# EAGLE schematic PCB Telemetria 2020 (EAGLE 9.5.2)

## Sheet 1 of 5: TBEAM
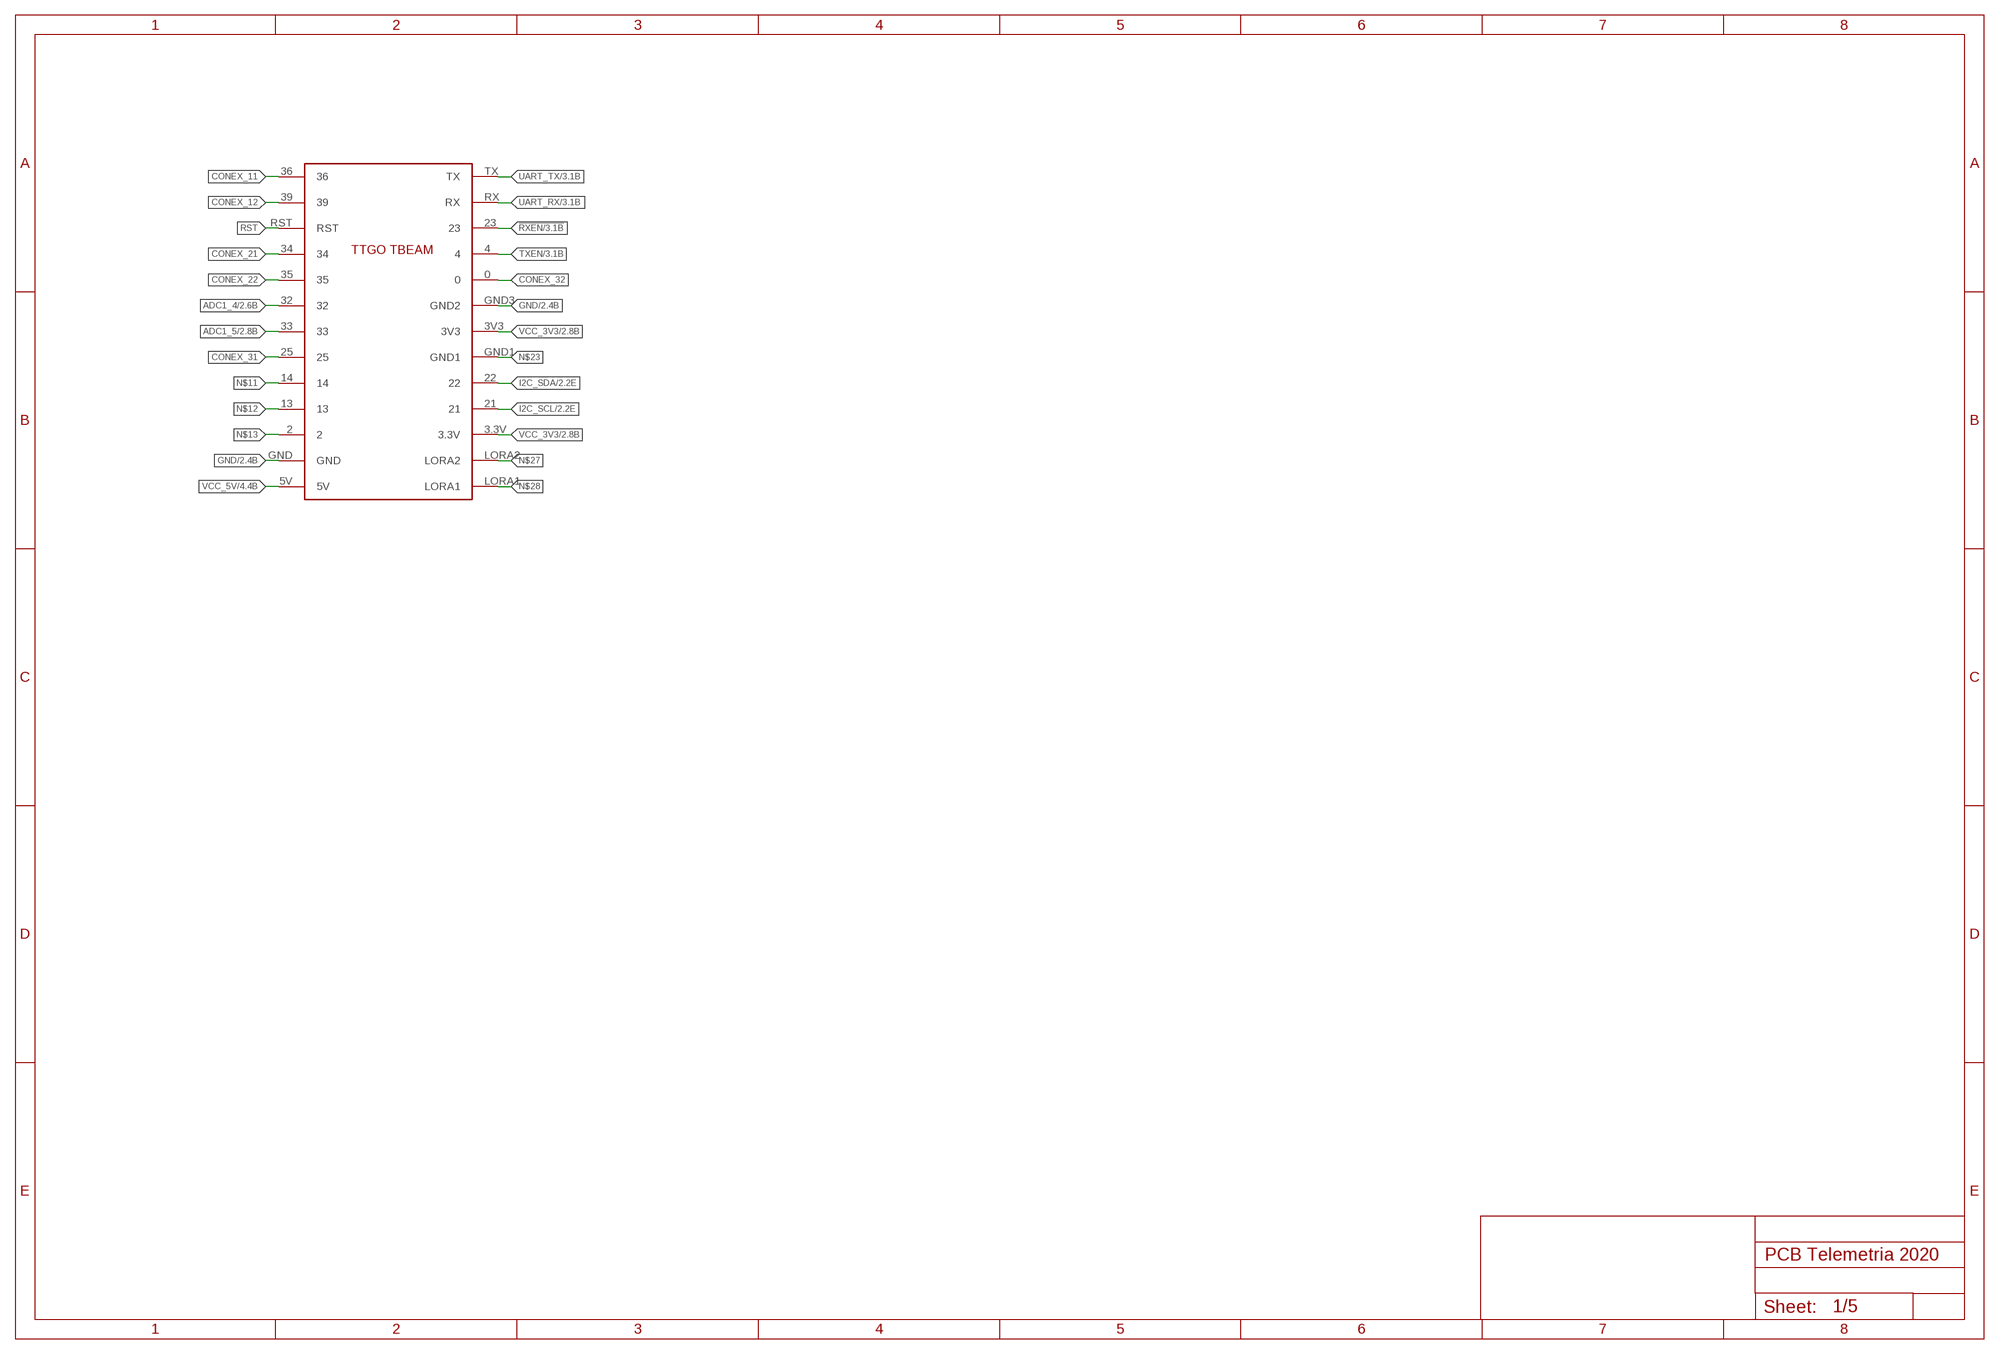
[diagram p0: schematic, sheet 1]

### Parts
U$1  TTGOBEAM  [TTGOBEAM]

### Nets
!RXEN: U$1.23 ; also sheet 3
ADC1_4: U$1.32 ; also sheet 2
ADC1_5: U$1.33 ; also sheet 2
CONEX_11: U$1.36
CONEX_12: U$1.39
CONEX_21: U$1.34
CONEX_22: U$1.35
CONEX_31: U$1.25
CONEX_32: U$1.0
GND: U$1.GND U$1.GND3(GND2) ; also sheet 2,3,4
I2C_SCL: U$1.21 ; also sheet 2
I2C_SDA: U$1.22 ; also sheet 2
N$11: U$1.14
N$12: U$1.13
N$13: U$1.2
N$23: U$1.GND1
N$27: U$1.LORA2
N$28: U$1.LORA1
RST: U$1.RST
TXEN: U$1.4 ; also sheet 3
UART_RX: U$1.RX ; also sheet 3
UART_TX: U$1.TX ; also sheet 3
VCC_3V3: U$1.3.3V U$1.3V3 ; also sheet 2,3,4
VCC_5V: U$1.5V ; also sheet 4

## Sheet 2 of 5: Analog Circuits
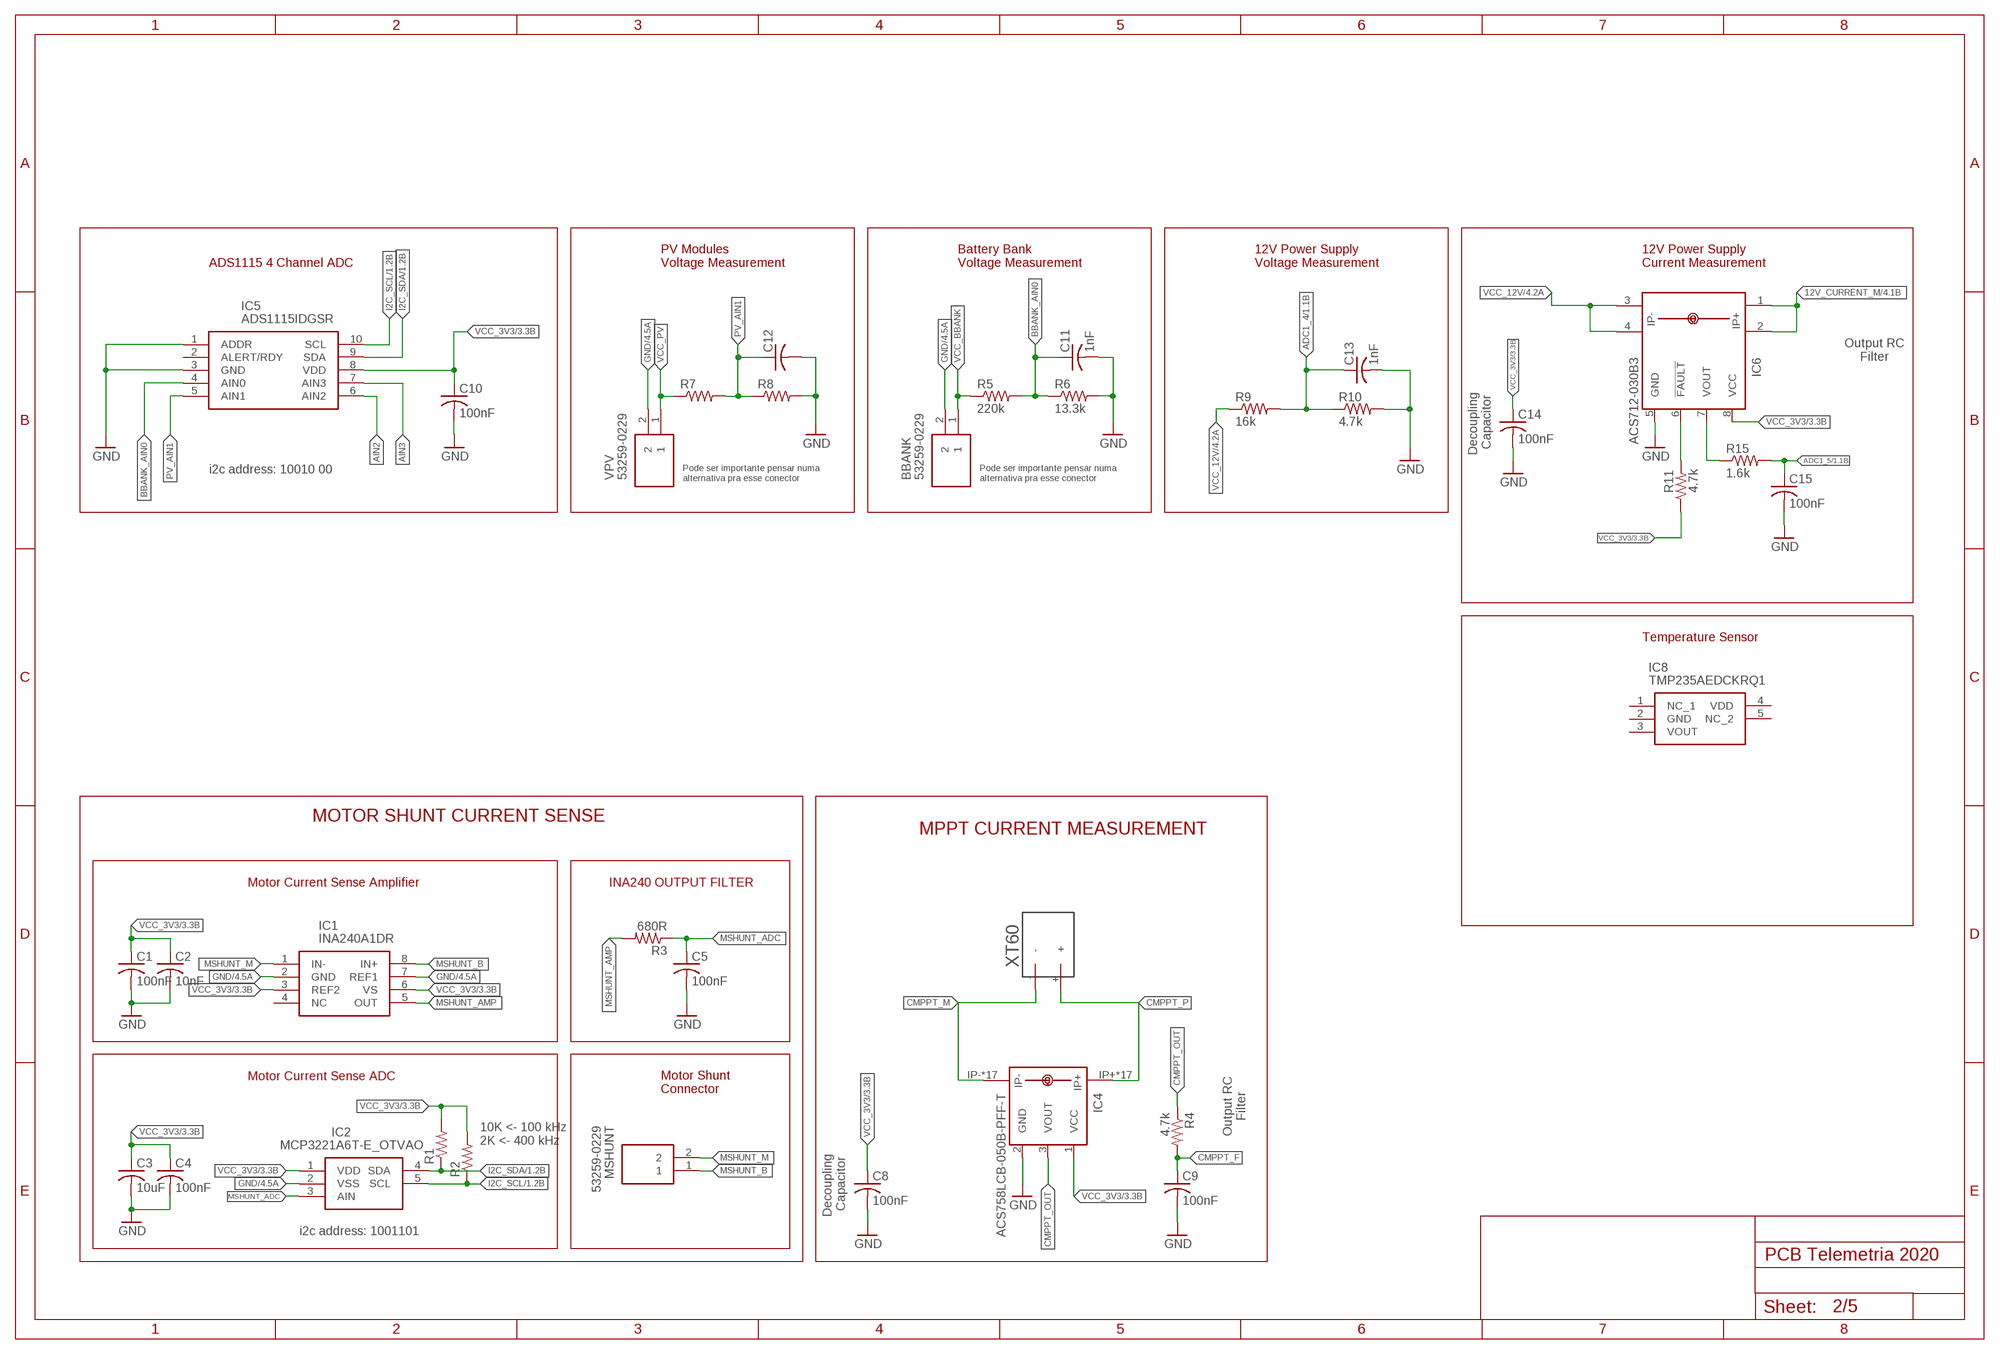
[diagram p1: schematic, sheet 2]

### Parts
BBANK  53259-0229  [0532590229]
C1  100nF  C-USC0805  [C0805]
C2  10nF  C-USC0805  [C0805]
C3  10uF  C-USC0805  [C0805]
C4  100nF  C-USC0805  [C0805]
C5  100nF  C-USC0805  [C0805]
C8  100nF  C-USC0805  [C0805]
C9  100nF  C-USC0805  [C0805]
C10  100nF  C-USC0805  [C0805]
C11  1nF  C-USC0805  [C0805]
C12  C-USC0805  [C0805]
C13  1nF  C-USC0805  [C0805]
C14  100nF  C-USC0805  [C0805]
C15  100nF  C-USC0805  [C0805]
IC1  INA240A1DR  [SOIC127P600X175-8N]
IC2  MCP3221A6T-E_OTVAO  [SOT95P280X145-5N]
IC4  ACS758LCB-050B-PFF-T  [CB-PFF]
IC5  ADS1115IDGSR  [SOP50P490X110-10N]
IC6  ACS712-030B3  ACS712-LC  [SOIC8]
IC8  TMP235AEDCKRQ1  [SOT65P210X110-5N]
MSHUNT  53259-0229  [0532590229]
R1  R-US_R0805  [R0805]
R2  R-US_R0805  [R0805]
R3  680R  R-US_R0805  [R0805]
R4  4.7k  R-US_R0805  [R0805]
R5  220k  R-US_R0805  [R0805]
R6  13.3k  R-US_R0805  [R0805]
R7  R-US_R0805  [R0805]
R8  R-US_R0805  [R0805]
R9  16k  R-US_R0805  [R0805]
R10  4.7k  R-US_R0805  [R0805]
R11  4.7k  R-US_R0805  [R0805]
R15  1.6k  R-US_R0805  [R0805]
U$3  XT60  [XT60]
VPV  53259-0229  [0532590229]

### Nets
12V_CURRENT_M: IC6.1(IP+) IC6.2(IP+1) ; also sheet 4
ADC1_4: C13.1 R9.2 R10.1 ; also sheet 1
ADC1_5: C15.1 R15.2 ; also sheet 1
AIN2: IC5.6(AIN2)
AIN3: IC5.7(AIN3)
BBANK_AIN0: C11.1 IC5.4(AIN0) R5.2 R6.1
CMPPT_F: C9.1 R4.2
CMPPT_M: IC4.IP- IC4.IP-@2(IP-) IC4.IP-@3(IP-) IC4.IP-@4(IP-) IC4.IP-@5(IP-) IC4.IP-@6(IP-) IC4.IP-@7(IP-) IC4.IP-@8(IP-) IC4.IP-@9(IP-) IC4.IP-@10(IP-) IC4.IP-@11(IP-) IC4.IP-@12(IP-) IC4.IP-@13(IP-) IC4.IP-@14(IP-) IC4.IP-@15(IP-) IC4.IP-@16(IP-) IC4.IP-@17(IP-) U$3.-
CMPPT_OUT: IC4.3(VOUT) R4.1
CMPPT_P: IC4.IP+ IC4.IP+@2(IP+) IC4.IP+@3(IP+) IC4.IP+@4(IP+) IC4.IP+@5(IP+) IC4.IP+@6(IP+) IC4.IP+@7(IP+) IC4.IP+@8(IP+) IC4.IP+@9(IP+) IC4.IP+@10(IP+) IC4.IP+@11(IP+) IC4.IP+@12(IP+) IC4.IP+@13(IP+) IC4.IP+@14(IP+) IC4.IP+@15(IP+) IC4.IP+@16(IP+) IC4.IP+@17(IP+) U$3.+
GND: BBANK.2 C1.2 C2.2 C3.2 C4.2 C5.2 C8.2 C9.2 C10.2 C11.2 C12.2 C13.2 C14.2 C15.2 IC1.2(GND) IC1.7(REF1) IC2.2(VSS) IC4.2(GND) IC5.1(ADDR) IC5.3(GND) IC6.5(GND) R6.2 R8.2 R10.2 VPV.2 ; also sheet 1,3,4
I2C_SCL: IC2.5(SCL) IC5.10(SCL) R2.1 ; also sheet 1
I2C_SDA: IC2.4(SDA) IC5.9(SDA) R1.1 ; also sheet 1
MSHUNT_ADC: C5.1 IC2.3(AIN) R3.1
MSHUNT_AMP: IC1.5(OUT) R3.2
MSHUNT_B: IC1.8(IN+) MSHUNT.1
MSHUNT_M: IC1.1(IN-) MSHUNT.2
N$1: IC6.6(!FAULT) R11.2
N$2: IC6.7(VOUT) R15.1
PV_AIN1: C12.1 IC5.5(AIN1) R7.2 R8.1
VCC_3V3: C1.1 C2.1 C3.1 C4.1 C8.1 C10.1 C14.1 IC1.3(REF2) IC1.6(VS) IC2.1(VDD) IC4.1(VCC) IC5.8(VDD) IC6.8(VCC) R1.2 R2.2 R11.1 ; also sheet 1,3,4
VCC_12V: IC6.3(IP-) IC6.4(IP-1) R9.1 ; also sheet 4
VCC_BBANK: BBANK.1 R5.1
VCC_PV: R7.1 VPV.1
Unconnected: IC1.4(NC) IC5.2(ALERT/RDY) IC8.1(NC_1) IC8.2(GND) IC8.3(VOUT) IC8.4(VDD) IC8.5(NC_2)

### Notes on the sheet
- ADS1115 4 Channel ADC
- PV Modules
  Voltage Measurement
- Battery Bank
  Voltage Measurement
- 12V Power Supply
  Voltage Measurement
- 12V Power Supply
  Current Measurement
- Output RC
  Filter
- Decoupling 
  Capacitor
- i2c address: 10010 00
- Pode ser importante pensar numa
  alternativa pra esse conector
- Pode ser importante pensar numa
  alternativa pra esse conector
- Temperature Sensor
- MOTOR SHUNT CURRENT SENSE
- MPPT CURRENT MEASUREMENT
- Motor Current Sense Amplifier | INA240 OUTPUT FILTER
- Motor Current Sense ADC
- Motor Shunt 
  Connector
- Output RC
  Filter
- 10K <- 100 kHz
  2K <- 400 kHz
- Decoupling 
  Capacitor
- i2c address: 1001101

## Sheet 3 of 5: Communication
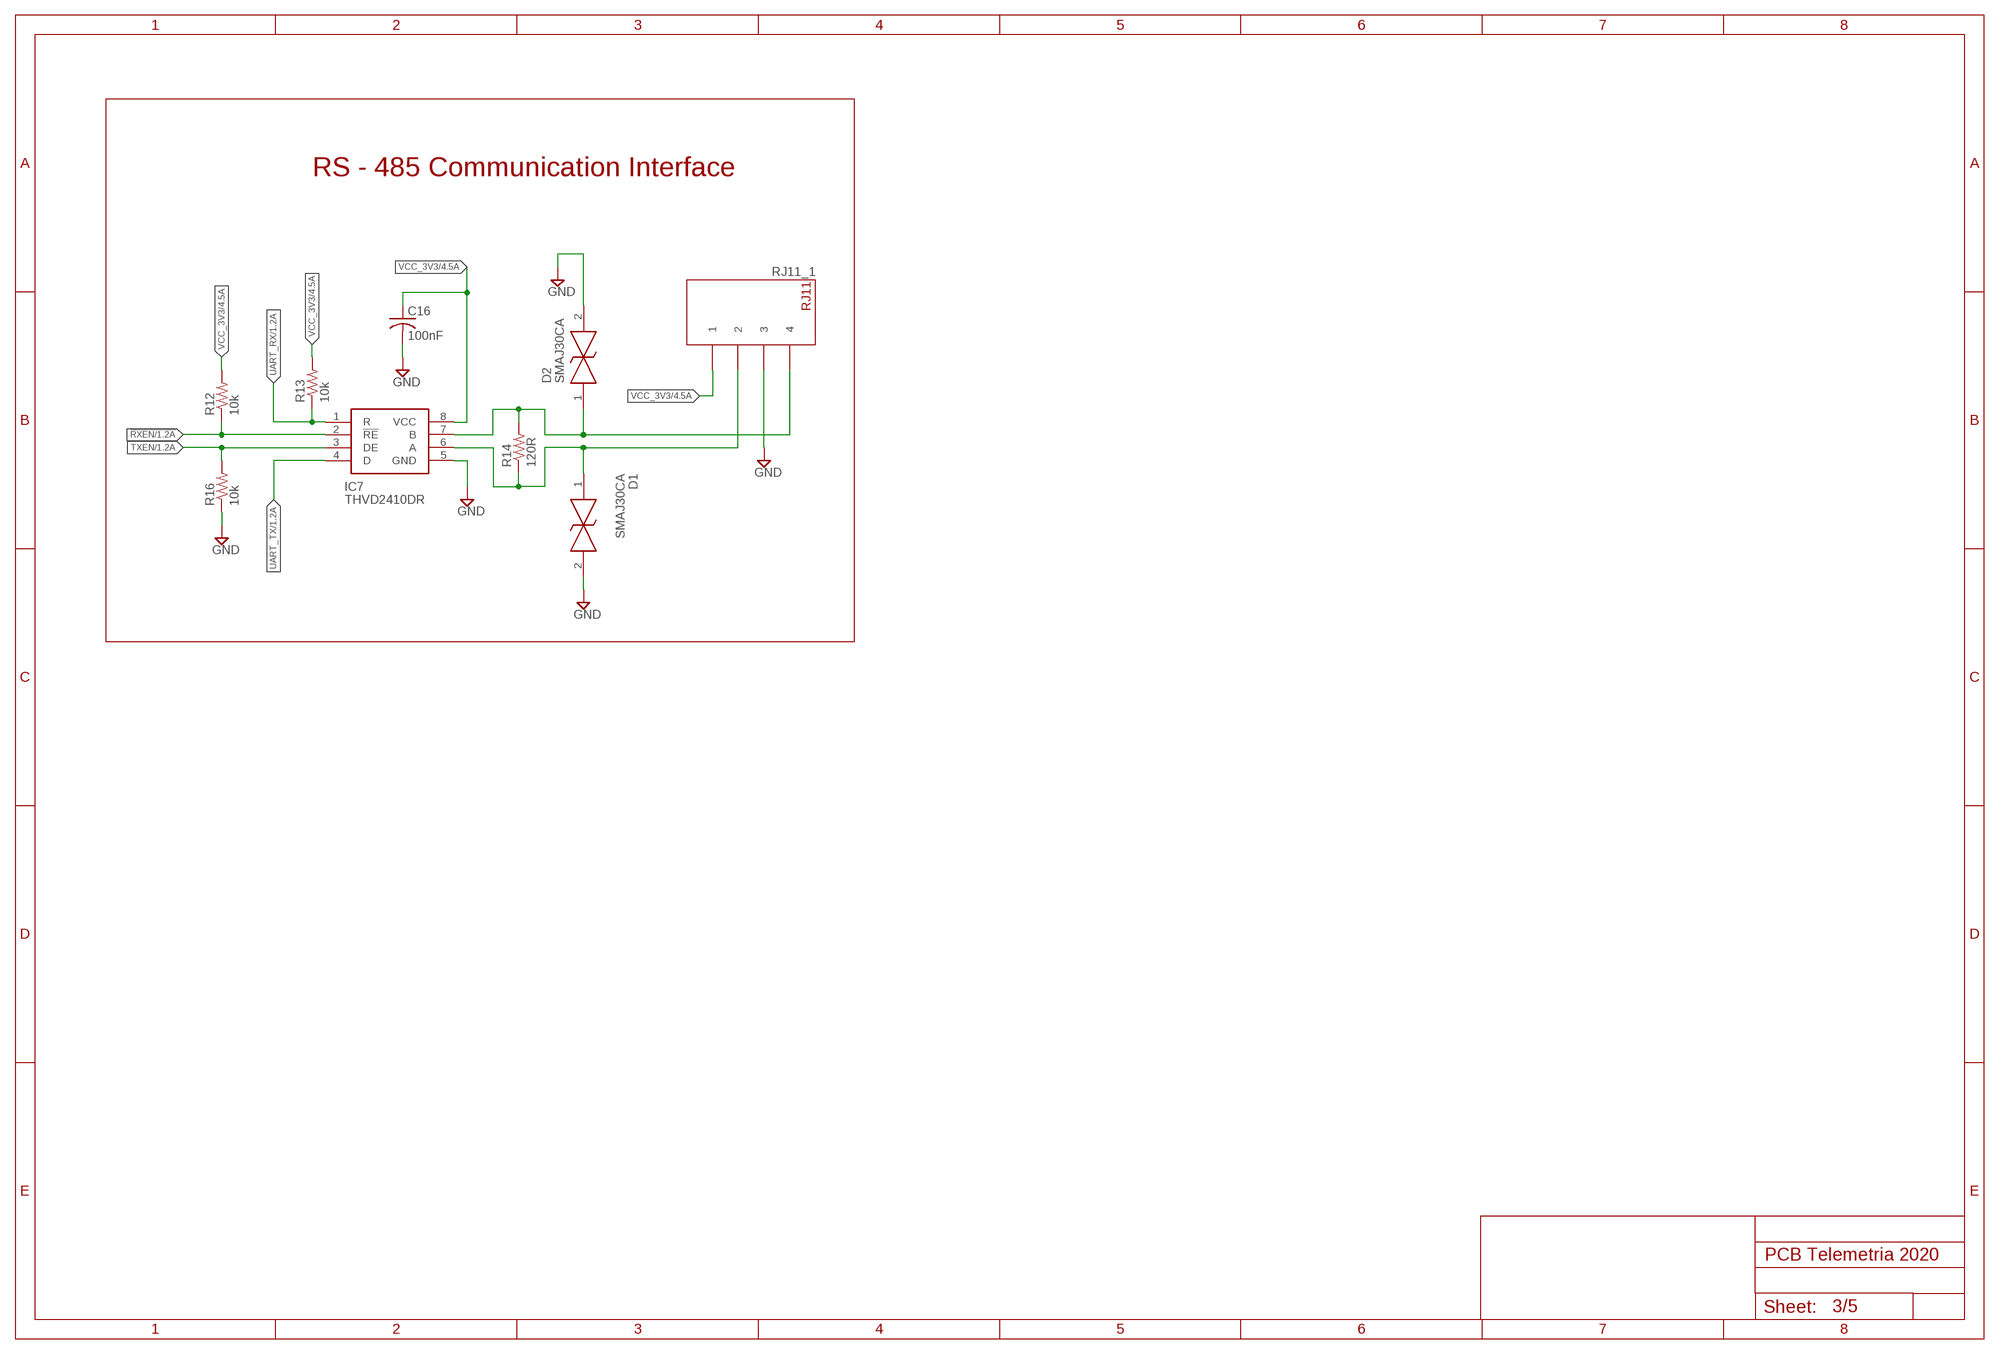
[diagram p2: schematic, sheet 3]

### Parts
C16  100nF  C-USC0805  [C0805]
D1  SMAJ30CA  [DIONM5026X229N]
D2  SMAJ30CA  [DIONM5026X229N]
IC7  THVD2410DR  [SOIC127P600X175-8N]
R12  10k  R-US_M0805  [M0805]
R13  10k  R-US_M0805  [M0805]
R14  120R  R-US_M0805  [M0805]
R16  10k  R-US_M0805  [M0805]
RJ11_1  TFC44  [TFC44]

### Nets
!RXEN: IC7.2(!RE) R12.1 ; also sheet 1
GND: C16.2 D1.2 D2.2 IC7.5(GND) R16.1 RJ11_1.P$3 ; also sheet 1,2,4
N$9: D1.1 IC7.6(A) R14.1 RJ11_1.P$2
N$14: D2.1 IC7.7(B) R14.2 RJ11_1.P$4
TXEN: IC7.3(DE) R16.2 ; also sheet 1
UART_RX: IC7.1(R) R13.1 ; also sheet 1
UART_TX: IC7.4(D) ; also sheet 1
VCC_3V3: C16.1 IC7.8(VCC) R12.2 R13.2 RJ11_1.P$1 ; also sheet 1,2,4

### Notes on the sheet
- RS - 485 Communication Interface

## Sheet 4 of 5: Power
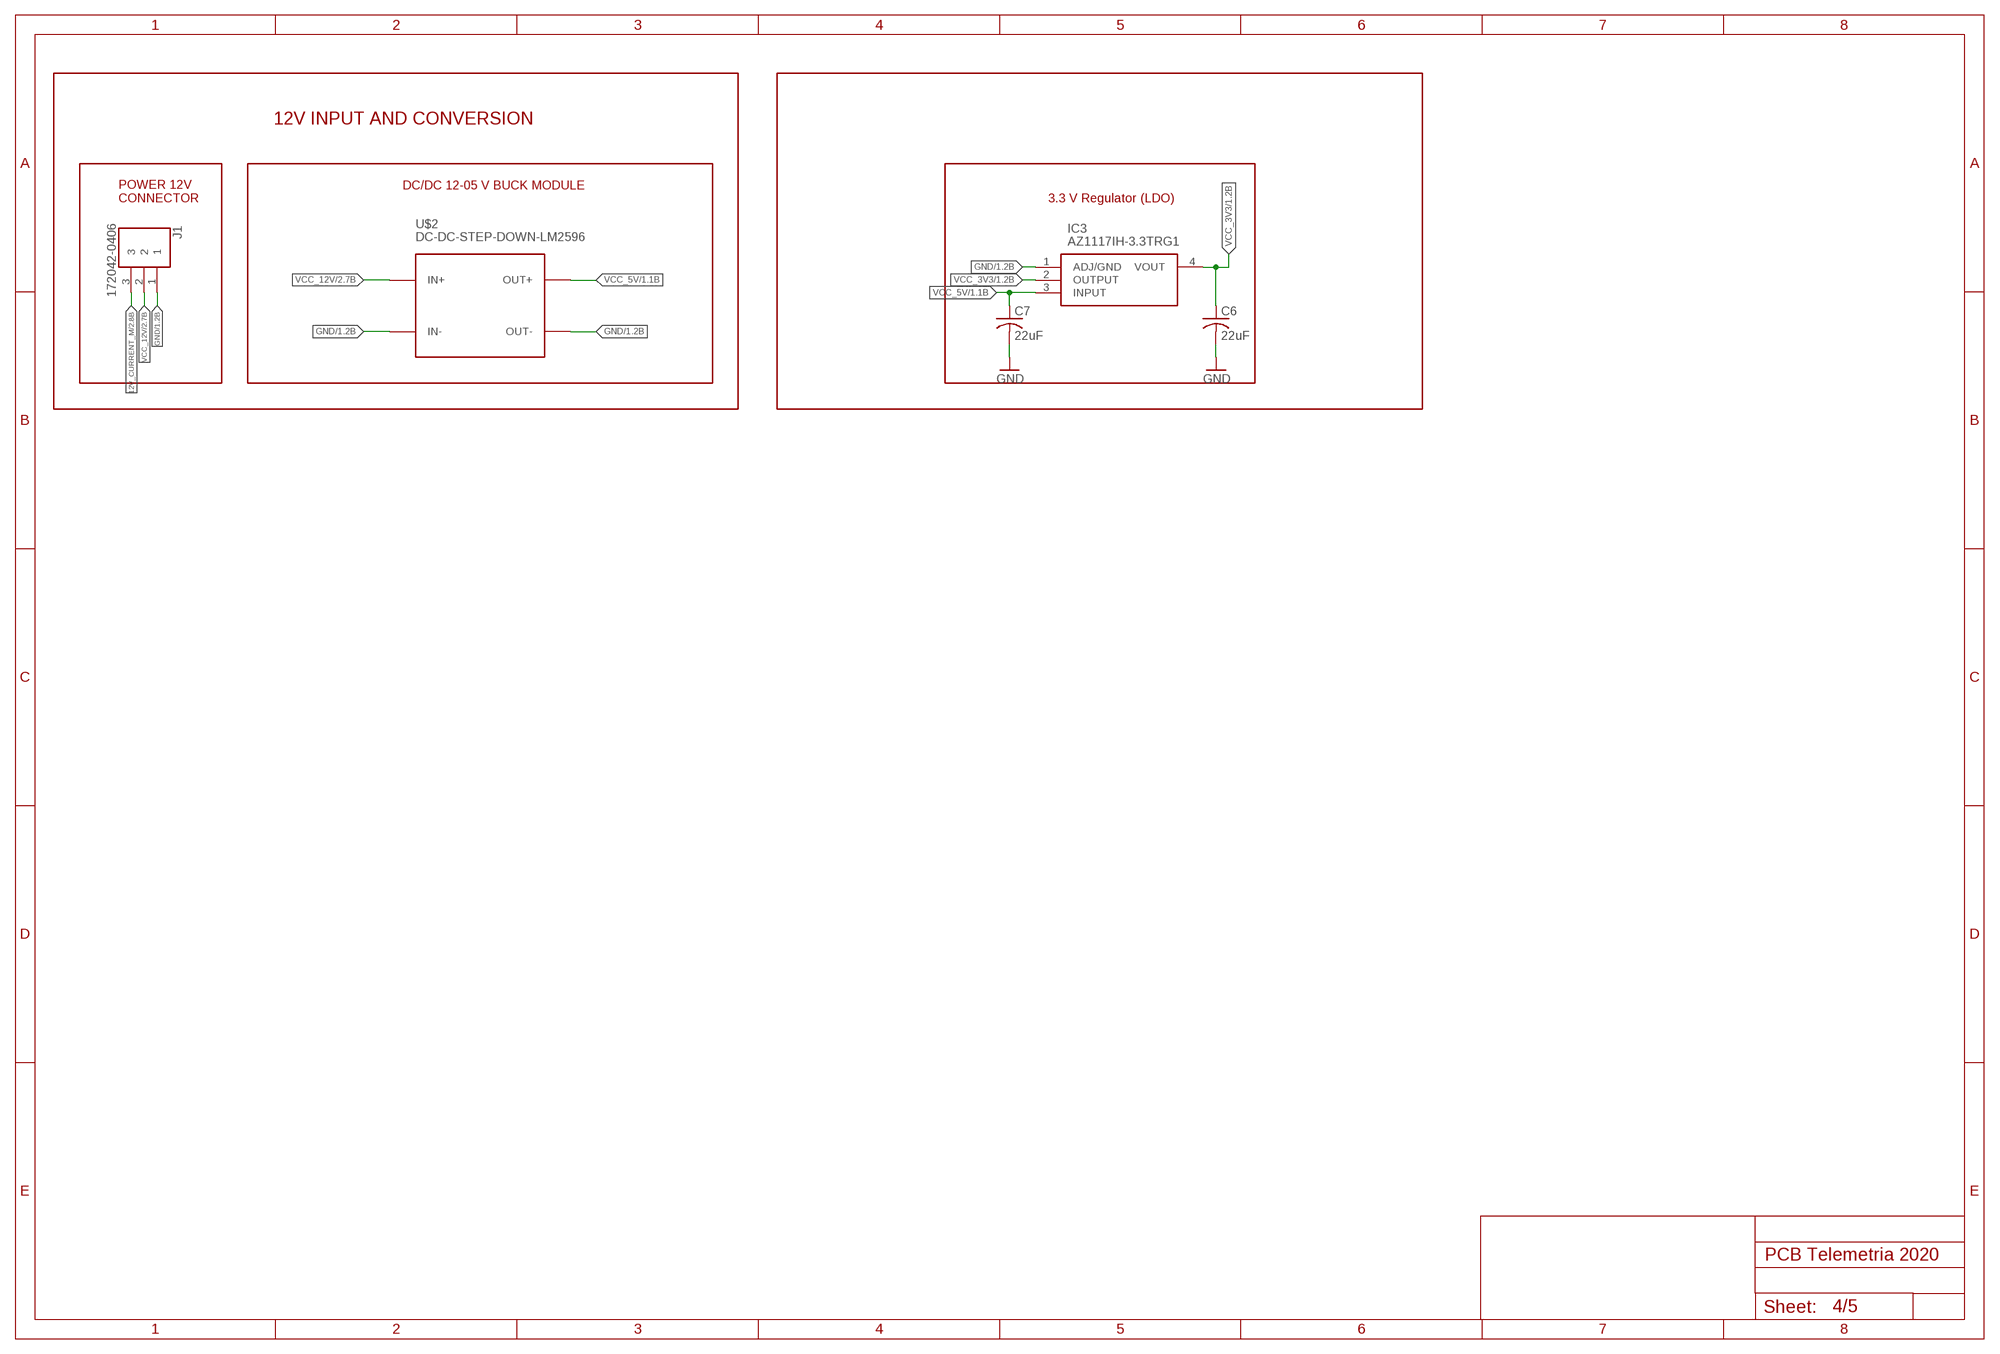
[diagram p3: schematic, sheet 4]

### Parts
C6  22uF  C-USC0805  [C0805]
C7  22uF  C-USC0805  [C0805]
IC3  AZ1117IH-3.3TRG1  [SOT230P700X170-4N]
J1  172042-0406  [MOLEX_172042-0406]
U$2  DC-DC-STEP-DOWN-LM2596  [DC-DC-STEP-DOWN-LM2596]

### Nets
12V_CURRENT_M: J1.3 ; also sheet 2
GND: C6.2 C7.2 IC3.1(ADJ/GND) J1.1 U$2.IN- U$2.OUT- ; also sheet 1,2,3
VCC_3V3: C6.1 IC3.2(OUTPUT) IC3.4(VOUT) ; also sheet 1,2,3
VCC_5V: C7.1 IC3.3(INPUT) U$2.OUT+ ; also sheet 1
VCC_12V: J1.2 U$2.IN+ ; also sheet 2

### Notes on the sheet
- 12V INPUT AND CONVERSION
- DC/DC 12-05 V BUCK MODULE
- POWER 12V
  CONNECTOR
- 3.3 V Regulator (LDO)

## Sheet 5 of 5: Extra Connectors
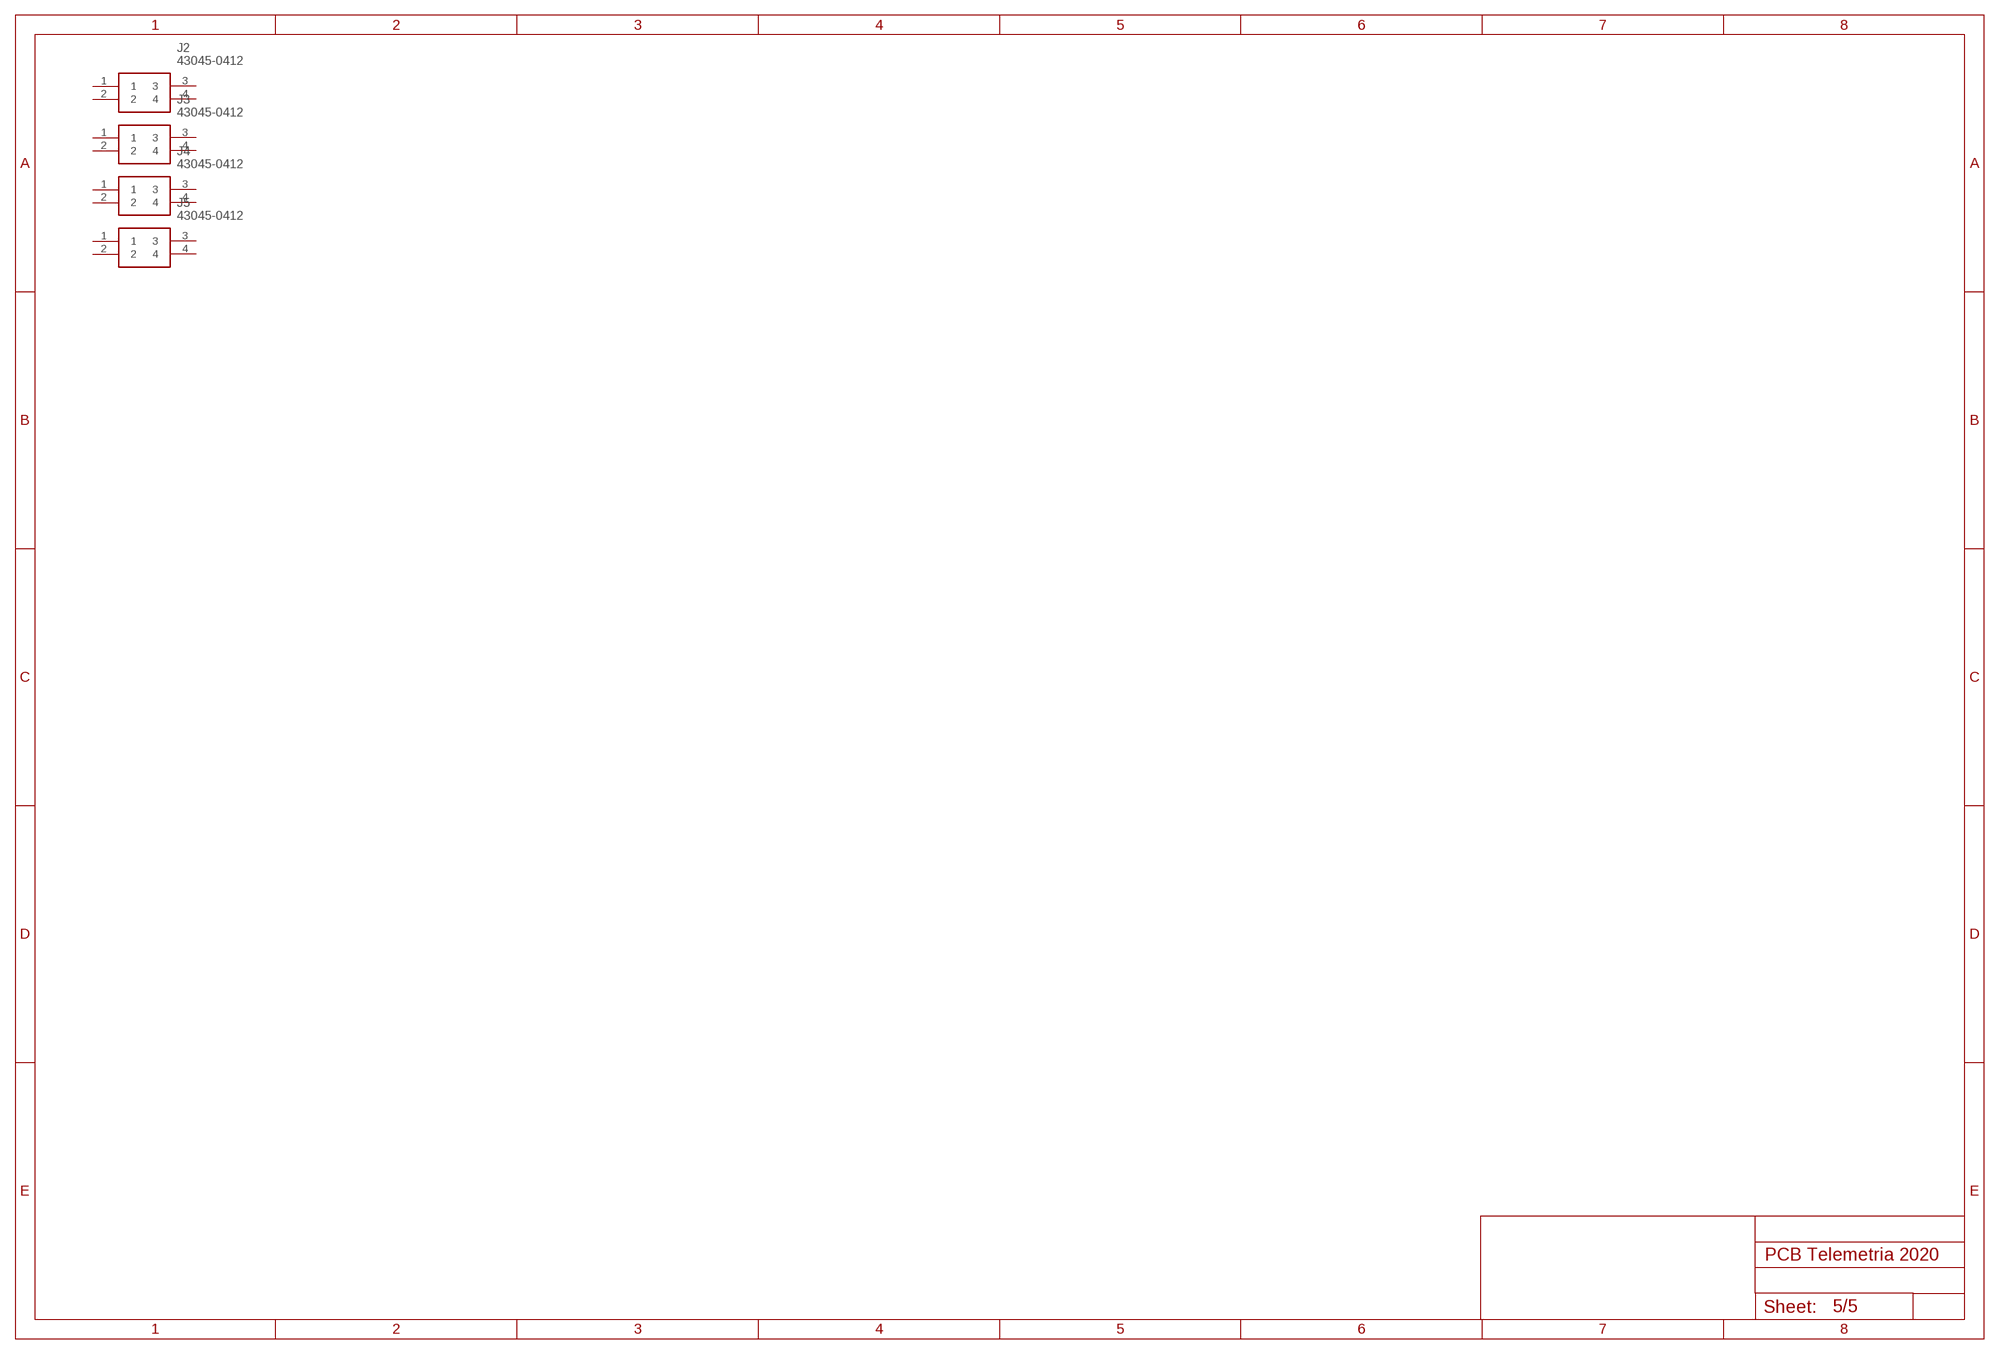
[diagram p4: schematic, sheet 5]

### Parts
J2  43045-0412  [43045-0412]
J3  43045-0412  [43045-0412]
J4  43045-0412  [43045-0412]
J5  43045-0412  [43045-0412]
Unconnected: J2.1 J2.2 J2.3 J2.4 J3.1 J3.2 J3.3 J3.4 J4.1 J4.2 J4.3 J4.4 J5.1 J5.2 J5.3 J5.4

## Library data of the parts
BBANK MSHUNT VPV = CON_MOLEX_53259-0229:53259-0229: Headers & Wire Housings 3.5 WtB Wafer Assy R B Wafer Assy RA 2Ckt Source: Datasheet <https://www.molex.com/webdocs/datasheets/pdf/en-us/0532590229_PCB_HEADERS.pdf>; DESCRIPTION: Headers & Wire Housings 3.5 WtB Wafer Assy R B Wafer Assy RA 2Ckt; HEIGHT: 7mm; MANUFACTURER_NAME: Molex; MANUFACTURER_PART_NUMBER: 53259-0229; MOUSER_PART_NUMBER: 538-53259-0229; MOUSER_PRICE-STOCK: https://www.mouser.co.uk/ProductDetail/Molex/53259-0229?qs=%2Fy5FSpUmAiGN4PmFvaThpA%3D%3D
C1-C16 = rcl:C-US: CAPACITOR, American symbol; SPICEPREFIX: C
D1 D2 = SamacSys_Parts:SMAJ30CA: Littelfuse SMAJ30CA, Bi-Directional TVS Diode, 400W, 2-Pin DO-214AC Source: Datasheet <https://www.mouser.se/datasheet/2/240/Littelfuse_TVS_Diode_SMAJ_Datasheet.pdf-540740.pdf>; DESCRIPTION: Littelfuse SMAJ30CA, Bi-Directional TVS Diode, 400W, 2-Pin DO-214AC; HEIGHT: 2.29mm; MANUFACTURER_NAME: LITTELFUSE; MANUFACTURER_PART_NUMBER: SMAJ30CA; MOUSER_PART_NUMBER: 576-SMAJ30CA; MOUSER_PRICE-STOCK: https://www.mouser.co.uk/ProductDetail/Littelfuse/SMAJ30CA?qs=HR2RnyOI4E7JQai5qAA1IA%3D%3D
IC1 = INA240A1DR:INA240A1DR: 80V, Low-/High-Side, Bi-Directional, Zero-Drift, Current Sense Amp w/Enhanced PWM Rejection Source: Datasheet <http://www.ti.com/lit/gpn/ina240>; DESCRIPTION: 80V, Low-/High-Side, Bi-Directional, Zero-Drift, Current Sense Amp w/Enhanced PWM Rejection; HEIGHT: 1.75mm; MANUFACTURER_NAME: Texas Instruments; MANUFACTURER_PART_NUMBER: INA240A1DR; MOUSER_PART_NUMBER: 595-INA240A1DR; MOUSER_PRICE-STOCK: https://www.mouser.co.uk/ProductDetail/Texas-Instruments/INA240A1DR?qs=AQlKX63v8Rv7XB07RTzuHA%3D%3D
IC2 = MCP3221A6T-E_OTVAO:MCP3221A6T-E_OTVAO: Analog to Digital Converters - ADC Automotive, 12-bit SAR ADC, I2C, single channel Source: Datasheet <https://www.arrow.com/en/products/mcp3221a6t-eotvao/microchip-technology>; DESCRIPTION: Analog to Digital Converters - ADC Automotive, 12-bit SAR ADC, I2C, single channel; HEIGHT: 1.45mm; MANUFACTURER_NAME: Microchip; MANUFACTURER_PART_NUMBER: MCP3221A6T-E/OTVAO; MOUSER_PART_NUMBER: 579-MCP3221A6TEOTVAO; MOUSER_PRICE-STOCK: https://www.mouser.co.uk/ProductDetail/Microchip-Technology/MCP3221A6T-E-OTVAO?qs=5aG0NVq1C4xIe7K3D%2FHE6g%3D%3D
IC3 = AZ1117IH-3.3TRG1:AZ1117IH-3.3TRG1: LDO Voltage Regulators LDO BJT HiCurr 1.35A 10Hz to 10KHz Source: Datasheet; DESCRIPTION: LDO Voltage Regulators LDO BJT HiCurr 1.35A 10Hz to 10KHz; HEIGHT: 1.7mm; MANUFACTURER_NAME: Diodes Inc.; MANUFACTURER_PART_NUMBER: AZ1117IH-3.3TRG1; MOUSER_PART_NUMBER: 621-AZ1117IH-3.3TRG1; MOUSER_PRICE-STOCK: https://www.mouser.co.uk/ProductDetail/Diodes-Incorporated/AZ1117IH-33TRG1?qs=cpo3%2FpBou2jnS4SxLgAVoA%3D%3D
IC4 = allegro:ACS758*: Thermally Enhanced, Fully Integrated, Hall Effect-Based Linear Current Sensor with 100 micro Ohm Current Conductor display layer 49 Reference in BRD and place VIAs on circles Source: http://www.allegromicro.com/en/Products/Part_Numbers/0758/0758.pdf; MPN: ACS758LCB-050B-PFF-T; OC_FARNELL: 1718997; OC_NEWARK: 04R7131
IC5 = SamacSys_Parts:ADS1115IDGSR: 16-Bit 860SPS 4-Ch Delta-Sigma ADC With PGA, Oscillator, Vref, Comparator, and I2C Source: Datasheet <http://www.ti.com/lit/gpn/ADS1115>; DESCRIPTION: 16-Bit 860SPS 4-Ch Delta-Sigma ADC With PGA, Oscillator, Vref, Comparator, and I2C; HEIGHT: 1.1mm; MANUFACTURER_NAME: Texas Instruments; MANUFACTURER_PART_NUMBER: ADS1115IDGSR; MOUSER_PART_NUMBER: 595-ADS1115IDGSR; MOUSER_PRICE-STOCK: https://www.mouser.co.uk/ProductDetail/Texas-Instruments/ADS1115IDGSR?qs=IK5e5L0zOXjKCJoVMhYO%2FQ%3D%3D
IC6 = allegro-2:ACS712-LC
IC7 = SamacSys_Parts:THVD2410DR: RS-485 Interface IC Source: Datasheet <https://www.ti.com/lit/ds/symlink/thvd2410.pdf>; DESCRIPTION: RS-485 Interface IC; HEIGHT: 1.75mm; MANUFACTURER_NAME: Texas Instruments; MANUFACTURER_PART_NUMBER: THVD2410DR; MOUSER_PART_NUMBER: 595-THVD2410DR; MOUSER_PRICE-STOCK: https://www.mouser.co.uk/ProductDetail/Texas-Instruments/THVD2410DR?qs=%252B6g0mu59x7L2L8jrQVCEYQ%3D%3D
IC8 = SamacSys_Parts:TMP235AEDCKRQ1: Board Mount Temperature Sensors Automotive grade, +/-0.5C analog output temperature sensor with 10 mV/C gain 5-SC70 -40 to 150 Source: Datasheet <https://www.ti.com/lit/gpn/TMP235-Q1>; DESCRIPTION: Board Mount Temperature Sensors Automotive grade, +/-0.5C analog output temperature sensor with 10 mV/C gain 5-SC70 -40 to 150; HEIGHT: 1.1mm; MANUFACTURER_NAME: Texas Instruments; MANUFACTURER_PART_NUMBER: TMP235AEDCKRQ1; MOUSER_PART_NUMBER: 595-TMP235AEDCKRQ1; MOUSER_PRICE-STOCK: https://www.mouser.co.uk/ProductDetail/Texas-Instruments/TMP235AEDCKRQ1?qs=T3oQrply3y86j8c6PmMwyA%3D%3D
J1 = 172042-0302:172042-0406: Super Sabre™ Vertical Header, 3 Circuit, Short Tail with Board Lock, Complies with the UL1977 finger proof stan; AVAILABILITY: Warning; DESCRIPTION: 3 Position Header, Male Blades Connector Solder 0.295 (7.50mm) Through Hole; MF: Molex; MP: 172042-0302; PACKAGE: None; PRICE: None
J2-J5 = SamacSys_Parts:43045-0412: Headers & Wire Housings 4 CKT VERT HEADER Source: Datasheet; DESCRIPTION: Headers & Wire Housings 4 CKT VERT HEADER; HEIGHT: mm; MANUFACTURER_NAME: Molex; MANUFACTURER_PART_NUMBER: 43045-0412; MOUSER_PART_NUMBER: 538-43045-0412; MOUSER_PRICE-STOCK: https://www.mouser.co.uk/ProductDetail/Molex/43045-0412?qs=UeCeOHRHQebPBbEMDLocEw%3D%3D
R1-R16 = rcl:R-US_: RESISTOR, American symbol; SPICEPREFIX: R
RJ11_1 = Painel-Facilidades:TFC44
U$1 = bibliotecattgo:TTGOBEAM
U$2 = diy-modules:DC-DC-STEP-DOWN-LM2596: DC/DC Step-Down Regulator based on LM2596-ADJ chip LM2596 datasheet available here: http://www.ti.com/lit/ds/symlink/lm2596.pdf Click here to find device on ebay.com <http://www.ebay.com/sch/lm2596+power+regulator>
U$3 = XT60:XT60: XT60